# EAGLE design pic_can_switch_v2 (EAGLE 4.16)
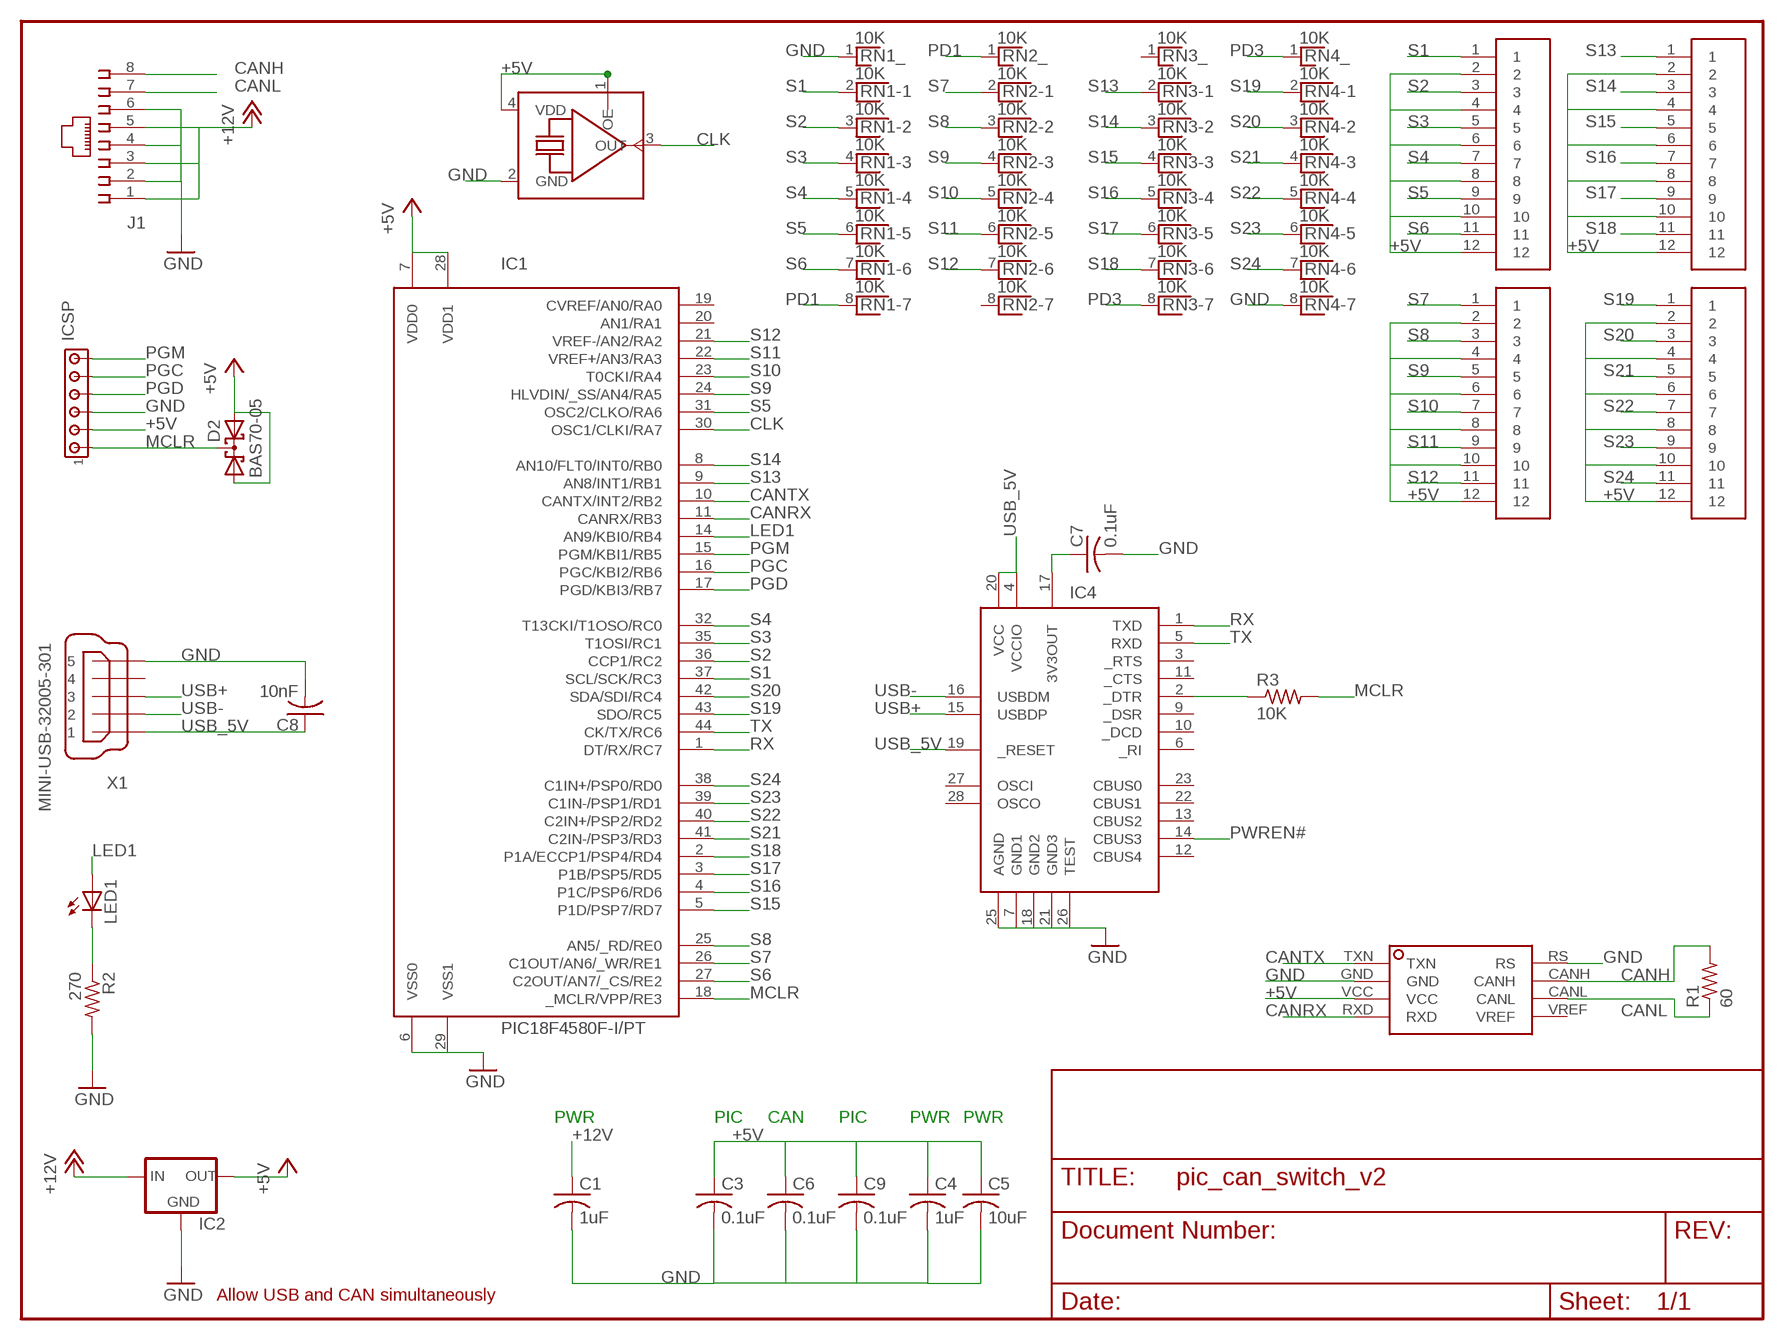
[diagram p0: schematic, sheet 1]

## Parts
C1  1uF  C-USC1206  [C1206]
C3  0.1uF  C-USC0805  [C0805]
C4  1uF  C-USC1206  [C1206]
C5  10uF  C-USC1210  [C1210]
C6  0.1uF  C-USC0805  [C0805]
C7  0.1uF  C-USC0805  [C0805]
C8  10nF  C-USC0805  [C0805]
C9  0.1uF  C-USC0805  [C0805]
D2  BAS70-05  [SOT23]
IC1  PIC18F4580F-I/PT  [TQFP44]
IC2  78XXL  [78XXL]
IC3  UC5350D  [SOIC8]
IC4  FT232RL  [SSOP28DB]
ICSP  MTA06-100  [10X06MTA]
J1  555166-1  [555166-1]
LED1  LEDCHIPLED_0805  [CHIPLED_0805]
R1  60  R-US_R0805  [R0805]
R2  270  R-US_R0805  [R0805]
R3  10K  R-US_R0805  [R0805]
RN1  10K  RNX7  [RN-8]
RN2  10K  RNX7  [RN-8]
RN3  10K  RNX7  [RN-8]
RN4  10K  RNX7  [RN-8]
TB1  MPT0.5/12-2.54  [MPT0.5/12-2.54]
TB2  MPT0.5/12-2.54  [MPT0.5/12-2.54]
TB3  MPT0.5/12-2.54  [MPT0.5/12-2.54]
TB4  MPT0.5/12-2.54  [MPT0.5/12-2.54]
U$1  CSX-750F  [CSX-750F]
X1  MINI-USB-32005-301  [32005-301]

## Nets
+5V: C3.1 C4.1 C5.1 C6.1 C9.1 D2.1(A1) D2.2(A2) IC1.7(VDD0) IC1.28(VDD1) IC2.OUT IC3.VCC ICSP.2 TB1.2 TB1.4 TB1.6 TB1.8 TB1.10 TB1.12 TB2.2 TB2.4 TB2.6 TB2.8 TB2.10 TB2.12 TB3.2 TB3.4 TB3.6 TB3.8 TB3.10 TB3.12 TB4.2 TB4.4 TB4.6 TB4.8 TB4.10 TB4.12 U$1.1(OE) U$1.4(VDD)
+12V: C1.1 IC2.IN J1.1 J1.3 J1.5
CANH: IC3.CANH J1.8 R1.2
CANL: IC3.CANL J1.7 R1.1
CANRX: IC1.11(CANRX/RB3) IC3.RXD
CANTX: IC1.10(CANTX/INT2/RB2) IC3.TXN
CLK: IC1.30(OSC1/CLKI/RA7) U$1.3(OUT)
GND: C1.2 C3.2 C4.2 C5.2 C6.2 C7.2 C8.2 C9.2 IC1.6(VSS0) IC1.29(VSS1) IC2.GND IC3.GND IC3.RS IC4.7(GND1) IC4.18(GND2) IC4.21(GND3) IC4.25(AGND) IC4.26(TEST) ICSP.3 J1.2 J1.4 J1.6 R2.2 RN1.1 RN4.8 U$1.2(GND) X1.5
LED1: IC1.14(AN9/KBI0/RB4) LED1.A
MCLR: D2.3(C) IC1.18(_MCLR/VPP/RE3) ICSP.1 R3.2
N$2: LED1.C R2.1
N$4: IC4.2(_DTR) R3.1
N$5: C7.1 IC4.17(3V3OUT)
PD1: RN1.8 RN2.1
PD3: RN3.8 RN4.1
PGC: IC1.16(PGC/KBI2/RB6) ICSP.5
PGD: IC1.17(PGD/KBI3/RB7) ICSP.4
PGM: IC1.15(PGM/KBI1/RB5) ICSP.6
PWREN#: IC4.14(CBUS3)
RX: IC1.1(DT/RX/RC7) IC4.1(TXD)
S1: IC1.37(SCL/SCK/RC3) RN1.2 TB1.1
S2: IC1.36(CCP1/RC2) RN1.3 TB1.3
S3: IC1.35(T1OSI/RC1) RN1.4 TB1.5
S4: IC1.32(T13CKI/T1OSO/RC0) RN1.5 TB1.7
S5: IC1.31(OSC2/CLKO/RA6) RN1.6 TB1.9
S6: IC1.27(C2OUT/AN7/_CS/RE2) RN1.7 TB1.11
S7: IC1.26(C1OUT/AN6/_WR/RE1) RN2.2 TB2.1
S8: IC1.25(AN5/_RD/RE0) RN2.3 TB2.3
S9: IC1.24(HLVDIN/_SS/AN4/RA5) RN2.4 TB2.5
S10: IC1.23(T0CKI/RA4) RN2.5 TB2.7
S11: IC1.22(VREF+/AN3/RA3) RN2.6 TB2.9
S12: IC1.21(VREF-/AN2/RA2) RN2.7 TB2.11
S13: IC1.9(AN8/INT1/RB1) RN3.2 TB3.1
S14: IC1.8(AN10/FLT0/INT0/RB0) RN3.3 TB3.3
S15: IC1.5(P1D/PSP7/RD7) RN3.4 TB3.5
S16: IC1.4(P1C/PSP6/RD6) RN3.5 TB3.7
S17: IC1.3(P1B/PSP5/RD5) RN3.6 TB3.9
S18: IC1.2(P1A/ECCP1/PSP4/RD4) RN3.7 TB3.11
S19: IC1.43(SDO/RC5) RN4.2 TB4.1
S20: IC1.42(SDA/SDI/RC4) RN4.3 TB4.3
S21: IC1.41(C2IN-/PSP3/RD3) RN4.4 TB4.5
S22: IC1.40(C2IN+/PSP2/RD2) RN4.5 TB4.7
S23: IC1.39(C1IN-/PSP1/RD1) RN4.6 TB4.9
S24: IC1.38(C1IN+/PSP0/RD0) RN4.7 TB4.11
TX: IC1.44(CK/TX/RC6) IC4.5(RXD)
USB+: IC4.15(USBDP) X1.3
USB-: IC4.16(USBDM) X1.2
USB_5V: C8.1 IC4.4(VCCIO) IC4.19(_RESET) IC4.20(VCC) X1.1
Unconnected: IC1.19(CVREF/AN0/RA0) IC1.20(AN1/RA1) IC3.VREF IC4.3(_RTS) IC4.6(_RI) IC4.9(_DSR) IC4.10(_DCD) IC4.11(_CTS) IC4.12(CBUS4) IC4.13(CBUS2) IC4.22(CBUS1) IC4.23(CBUS0) IC4.27(OSCI) IC4.28(OSCO) RN2.8 RN3.1 X1.4

## Notes on the sheet
- PWR | PIC | CAN | PIC | PWR | PWR
- Allow USB and CAN simultaneously

## Library data of the parts
C1 C3-C9 = rcl:C-US: CAPACITOR, American symbol
D2 = diode:BAS70-05: Silicon Schottky Diodes General-purpose diode for high-speed switching
IC1 = microchip-pic18f2480_2580_4480_4580:PIC18F4580: Microchip <http://microchip.com> PIC18F4580 <http://www.microchip.com/stellent/idcplg?IdcService=SS_GET_PAGE&nodeId=1335&dDocName=en020615> FLASH Microcontroller Changelog 20060722 Brandon Fosdick <http://bfoz.net><bfoz@bfoz.net> Device entry cloned from PIC18*4550 Massive HTML fixup Device Features Feature PIC18*4550 Program Memory (bytes) 32K Program Memory (instructions) 16384 I/O Pins 36 I/O Ports A, B, C, D, E Capture/Compare/PWM Modules 1 Enhanced Capture/Compare/PWM Modules 1 Parallel Communications (PSP) Yes 10-bit Analog-to-Digital Module 13 input Channels Package Types 40-pin PDIP 44-pin TQFP 44-pin QFN Notes: F only after 18, means standard voltage range from 4.2v to 5.5v LF after 18, means extended voltage range from 2.0v to 5.5v T after entire device number, means supplied in tape and reel TQFP packages only -E before / denotes extended temperature range from -40°C to +120°C -I before / denotes industrial temperature range from -40°C to +85°C /PT suffix denotes TQFP package /SO suffix denotes SOIC package /SP suffix denotes Skinny Plastic DIP package /P suffix denotes Plastic DIP package /ML suffix denotes QFN package
IC2 = v-reg:78XXL: VOLTAGE REGULATOR
IC3 = house:UC5350: CAN Tranceiver
IC4 = ftdichip:FT232RL: USB UART 4th Generation USB UART (USB <-> Serial) Controller
ICSP = con-amp:MTA06-100: AMP connector
J1 = con-amp:555166-1: AMP connector
LED1 = led:LED: LED OSRAM: - CHIPLED LG R971, LG N971, LY N971, LG Q971, LY Q971, LO R971, LY R971 LH N974, LH R974 LS Q976, LO Q976, LY Q976 LO Q996 - Hyper CHIPLED LW Q18S LB Q993, LB Q99A, LB R99A - SideLED LS A670, LO A670, LY A670, LG A670, LP A670 LB A673, LV A673, LT A673, LW A673 LH A674 LY A675 LS A676, LA A676, LO A676, LY A676, LW A676 LS A679, LY A679, LG A679 - Hyper Micro SIDELED® LS Y876, LA Y876, LO Y876, LY Y876 LT Y87S - SmartLED LW L88C, LW L88S LB L89C, LB L89S, LG L890 LS L89K, LO L89K, LY L89K LS L896, LA L896, LO L896, LY L896 - TOPLED LS T670, LO T670, LY T670, LG T670, LP T670 LSG T670, LSP T670, LSY T670, LOP T670, LYG T670 LG T671, LOG T671, LSG T671 LB T673, LV T673, LT T673, LW T673 LH T674 LS T676, LA T676, LO T676, LY T676, LB T676, LH T676, LSB T676, LW T676 LB T67C, LV T67C, LT T67C, LS T67K, LO T67K, LY T67K, LW E67C LS E67B, LA E67B, LO E67B, LY E67B, LB E67C, LV E67C, LT E67C LW T67C LS T679, LY T679, LG T679 LS T770, LO T770, LY T770, LG T770, LP T770 LB T773, LV T773, LT T773, LW T773 LH T774 LS E675, LA E675, LY E675, LS T675 LS T776, LA T776, LO T776, LY T776, LB T776 LHGB T686 LT T68C, LB T68C - Hyper Mini TOPLED® LB M676 - Mini TOPLED Santana® LG M470 LS M47K, LO M47K, LY M47K Source: http://www.osram.convergy.de - LUMILED® LXK2-PW12-R00, LXK2-PW12-S00, LXK2-PW14-U00, LXK2-PW14-V00 LXK2-PM12-R00, LXK2-PM12-S00, LXK2-PM14-U00 LXK2-PE12-Q00, LXK2-PE12-R00, LXK2-PE12-S00, LXK2-PE14-T00, LXK2-PE14-U00 LXK2-PB12-K00, LXK2-PB12-L00, LXK2-PB12-M00, LXK2-PB14-N00, LXK2-PB14-P00, LXK2-PB14-Q00 LXK2-PR12-L00, LXK2-PR12-M00, LXK2-PR14-Q00, LXK2-PR14-R00 LXK2-PD12-Q00, LXK2-PD12-R00, LXK2-PD12-S00 LXK2-PH12-R00, LXK2-PH12-S00 LXK2-PL12-P00, LXK2-PL12-Q00, LXK2-PL12-R00 Source: www.luxeon.com
R1-R3 = rcl:R-US_: RESISTOR, American symbol
RN1-RN4 = resistor-net:RNX7: RESISTOR NETWORK
TB1-TB4 = house:MPT0.5: Pheonix Contact Micro-Pitch Terminal Block
U$1 = house:CSX-750F: Citizen CMOS/TTL SMD Oscillator
X1 = con-cypressindustries:MINI-USB-: MINI USB-B Conector Source: www.cypressindustries.com

## Board
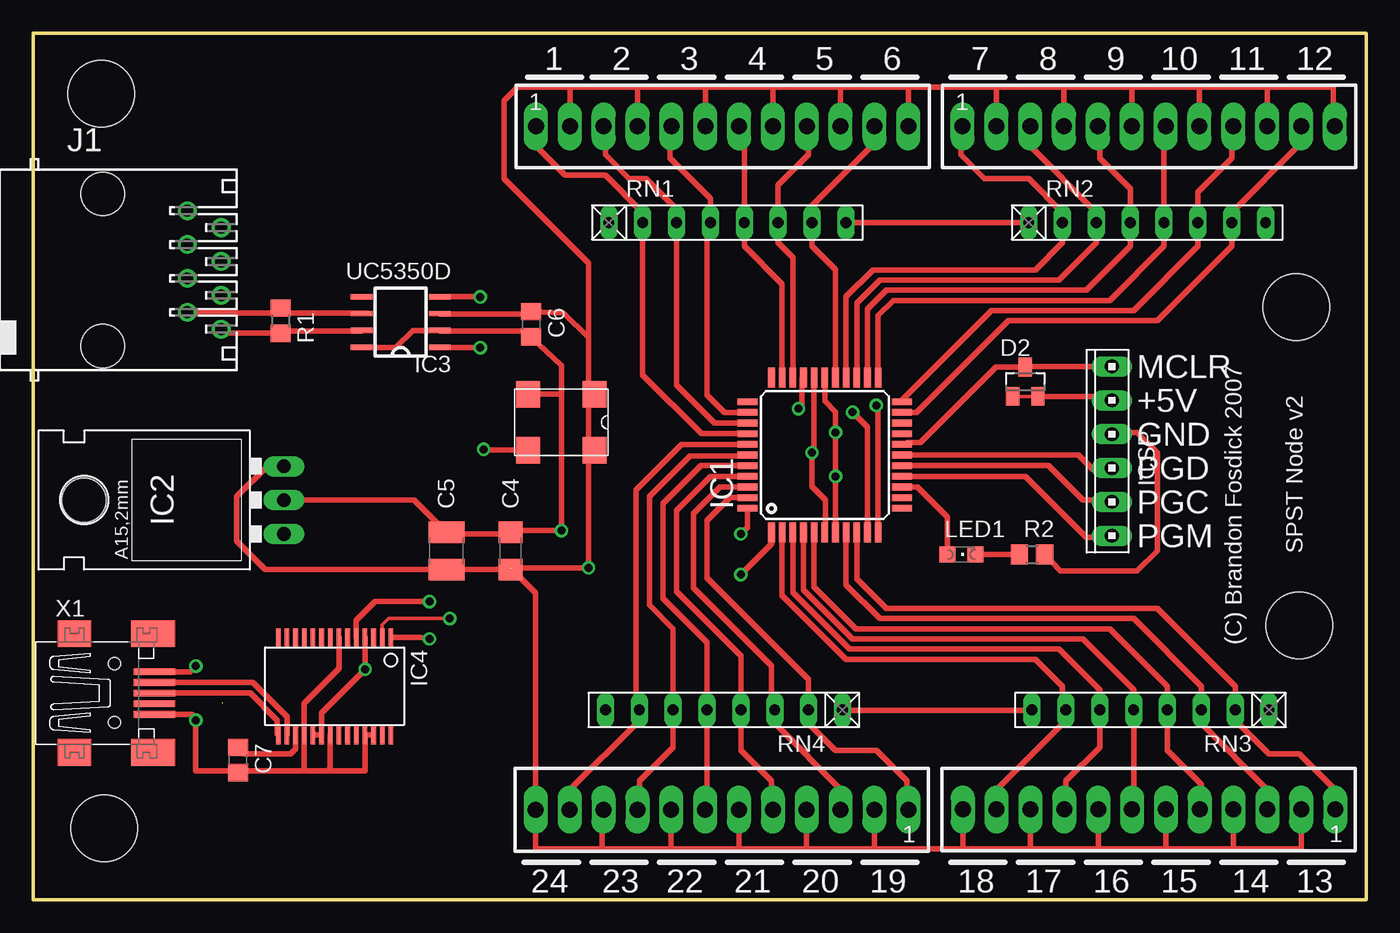
[diagram p1: board, top side]
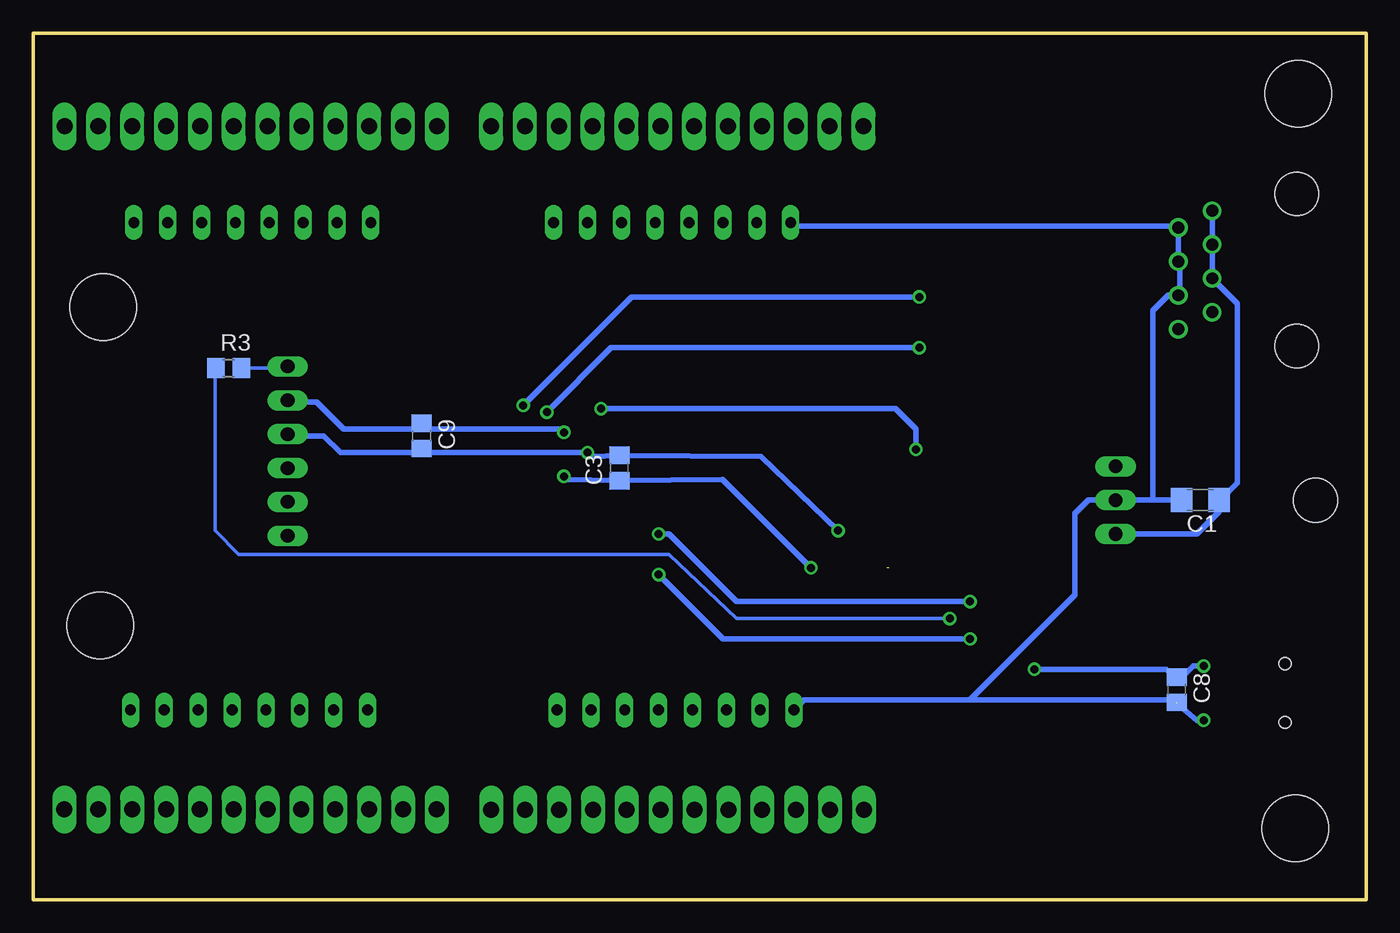
[diagram p2: board, bottom side, seen from below]

Size 100 x 65 mm. Coordinates in mm from the lower left corner, seen from the top.
Outline: 0,0 0,65 100,65 100,0 0,0
Copper layers (1*16): Top 0.035mm / dielectric 1.5mm / Bottom 0.035mm
Design rules "default": minimum track width 10mil, minimum drill 24mil, track to track 8mil, track to pad 8mil, pad to pad 8mil, via to via 8mil, smd to smd 8mil, copper to edge 40mil, drill to drill 8mil, minimum pad ring 10mil, minimum via ring 8mil, stop-mask expansion 0mil, vias tented up to drill 0mil, thermal gap 10mil
Holes 5 mm at 5.08,60.45 5.33,5.33 94.74,44.45 95,20.57

### Footprints (pad centres in the part's own frame; a part is rotated, then mirrored left to right if it is on the bottom)
C1206 = smd 1.6 x 1.8: 1 -1.4,0; 2 1.4,0
C0805 = smd 1.3 x 1.5: 1 -0.95,0; 2 0.95,0
C1210 = smd 1.6 x 2.7: 1 -1.4,0; 2 1.4,0
SOT23 = smd 1 x 1.4: 1 -0.95,-1.1; 2 0.95,-1.1; 3 0,1.1
TQFP44 = smd 1.5 x 0.5: 1 -5.8,4; 2 -5.8,3.2; 3 -5.8,2.4; 4 -5.8,1.6; 5 -5.8,0.8; 6 -5.8,0; 7 -5.8,-0.8; 8 -5.8,-1.6; 9 -5.8,-2.4; 10 -5.8,-3.2; 11 -5.8,-4; 23 5.8,-4; 24 5.8,-3.2; 25 5.8,-2.4; 26 5.8,-1.6; 27 5.8,-0.8; 28 5.8,0; 29 5.8,0.8; 30 5.8,1.6; 31 5.8,2.4; 32 5.8,3.2; 33 5.8,4 | smd 0.5 x 1.5: 12 -4,-5.8; 13 -3.2,-5.8; 14 -2.4,-5.8; 15 -1.6,-5.8; 16 -0.8,-5.8; 17 0,-5.8; 18 0.8,-5.8; 19 1.6,-5.8; 20 2.4,-5.8; 21 3.2,-5.8; 22 4,-5.8; 34 4,5.8; 35 3.2,5.8; 36 2.4,5.8; 37 1.6,5.8; 38 0.8,5.8; 39 0,5.8; 40 -0.8,5.8; 41 -1.6,5.8; 42 -2.4,5.8; 43 -3.2,5.8; 44 -4,5.8
78XXL = drill 1.016 long: GND 0,-3.81; IN -2.54,-3.81; OUT 2.54,-3.81 | hole 3.302: 0,11.176
SOIC8 = smd 1.626 x 0.406: CANH 2.934,1.27; CANL 2.934,0; GND -2.934,1.27; RS 2.934,2.54; RXD -2.934,-1.27; TXN -2.934,2.54; VCC -2.934,0; VREF 2.934,-1.27
SSOP28DB = smd 0.348 x 1.397: 1 -4.225,-3.656; 2 -3.575,-3.656; 3 -2.925,-3.656; 4 -2.275,-3.656; 5 -1.625,-3.656; 6 -0.975,-3.656; 7 -0.325,-3.656; 8 0.325,-3.656; 9 0.975,-3.656; 10 1.625,-3.656; 11 2.275,-3.656; 12 2.925,-3.656; 13 3.575,-3.656; 14 4.225,-3.656; 15 4.225,3.656; 16 3.575,3.656; 17 2.925,3.656; 18 2.275,3.656; 19 1.625,3.656; 20 0.975,3.656; 21 0.325,3.656; 22 -0.325,3.656; 23 -0.975,3.656; 24 -1.625,3.656; 25 -2.275,3.656; 26 -2.925,3.656; 27 -3.575,3.656; 28 -4.225,3.656
10X06MTA = drill 1.016 long: 1 6.35,0; 2 3.81,0; 3 1.27,0; 4 -1.27,0; 5 -3.81,0; 6 -6.35,0
555166-1 = drill 0.889 round: 1 -4.445,5.207; 2 -3.175,7.747; 3 -1.905,5.207; 4 -0.635,7.747; 5 0.635,5.207; 6 1.905,7.747; 7 3.175,5.207; 8 4.445,7.747 | hole 3.251: -5.715,-1.143; 5.715,-1.143
CHIPLED_0805 = smd 1.2 x 1.2: A 0,-1.05; C 0,1.05
R0805 = smd 1.3 x 1.5: 1 -0.95,0; 2 0.95,0
RN-8 = drill 0.813 long: 1 -8.89,0; 2 -6.35,0; 3 -3.81,0; 4 -1.27,0; 5 1.27,0; 6 3.81,0; 7 6.35,0; 8 8.89,0
MPT0.5/12-2.54 = drill 1.2 long: 1 -12.7,0; 2 -10.16,0; 3 -7.62,0; 4 -5.08,0; 5 -2.54,0; 6 0,0; 7 2.54,0; 8 5.08,0; 9 7.62,0; 10 10.16,0; 11 12.7,0; 12 15.24,0
CSX-750F = smd 1.8 x 2: 1 -2.5,-2.1; 2 2.5,-2.1; 3 2.5,2.1; 4 -2.5,2.1
32005-301 = smd 3.1 x 0.5: 1 3,1.6; 2 3,0.8; 3 3,0; 4 3,-0.8; 5 3,-1.6 | smd 2.5 x 2: M1 -3,-4.45; M2 -3,4.45 | smd 3.3 x 2: M3 2.9,4.45; M4 2.9,-4.45 | hole 0.9: 0,2.2; 0,-2.2

### Placement (x,y rotation side)
C1  12.45,29.97 180 bottom
C3  56.03,32.38 90 bottom
C4  35.81,26.16 90 top
C5  30.99,26.16 90 top
C6  37.36,43.17 270 top
C7  15.36,10.47 270 top
C8  14.22,15.75 270 bottom
C9  70.87,34.8 270 bottom
D2  74.42,38.86 0 top
IC1  59.38,33.35 90 top
IC2  14.99,29.97 90 top
IC3  27.56,43.97 180 top
IC4  22.61,16 180 top
ICSP  80.92,33.65 90 top
J1  6.35,47.24 270 top
LED1  69.63,25.89 270 top
R1  18.54,43.43 270 top
R2  74.93,25.91 0 top
R3  85.34,39.88 0 bottom
RN1  52.07,50.8 0 top
RN2  83.57,50.8 0 top
RN3  83.82,14.22 180 top
RN4  51.82,14.22 180 top
TB1  50.41,58.02 0 top
TB2  82.42,58.02 0 top
TB3  84.97,6.75 180 top
TB4  52.94,6.74 180 top
U$1  39.62,35.81 180 top
X1  6.1,15.49 0 top

### Tracks (layer width: path | path; a pad name or v marks a point on that pad's centre or on a via)
+5V  (via drill 0.6)  (1 unrouted)
  Top 0.254: ICSP.2 80.91,37.46 80.6,37.76 | 75.44,37.76 D2.2 | D2.1 75.44,37.76 | 75.44,37.76 75.44,37.59
  Top 0.406: 30.86,24.76 C5.1 17.4,24.76 15.24,26.92 15.24,30.23 17.53,32.51 IC2.OUT | 30.86,24.76 C4.1 35.94,24.89 v41.66,24.89 41.66,28.45 | 30.86,24.76 30.73,24.64 | 41.66,28.45 41.66,28.7 | TB1.2 40.25,60.96 40.13,60.96 | 40.13,60.96 36.32,60.96 35.31,59.94 35.31,54.1 41.66,47.75 41.66,42.16 | 41.66,28.45 41.66,33.78 | 41.66,33.78 41.66,37.85 | 41.66,37.85 41.66,42.16 | IC3.VCC 30.52,43.94 37.34,43.94 37.34,44 C6.1 39.8,44.02 41.66,42.16 | TB1.4 45.33,60.96 45.21,60.96 | 40.13,60.96 45.21,60.96 | TB1.6 50.41,60.96 50.29,60.96 | 45.21,60.96 50.29,60.96 | TB1.8 55.49,60.96 55.37,60.96 | 50.29,60.96 55.37,60.96 | TB1.10 60.57,60.96 60.45,60.96 | 55.37,60.96 60.45,60.96 | 65.65,60.96 TB1.12 | 60.45,60.96 65.65,60.96 | 72.26,60.96 TB2.2 | 65.65,60.96 72.26,60.96 | TB2.4 77.34,60.96 77.22,60.96 | 72.26,60.96 77.22,60.96 | TB2.6 82.42,60.96 82.3,60.96 | 77.22,60.96 82.3,60.96 | TB2.8 87.5,60.96 87.38,60.96 | 82.3,60.96 87.38,60.96 | TB2.10 92.58,60.96 92.46,60.96 | 87.38,60.96 92.46,60.96 | TB2.12 97.66,57.91 97.54,57.91 97.54,60.96 92.46,60.96 | IC1.28 59.38,37.4 60.2,36.58 v60.2,35.05 v60.2,31.75 60.2,27.69 60.18,27.67 IC1.7 | 42.67,3.81 37.7,3.81 TB4.12 37.7,23.01 35.81,24.89 | 42.78,6.6 42.93,6.6 | 42.78,6.6 TB4.10 | 42.67,3.81 42.67,6.6 42.78,6.6 | 47.86,3.81 TB4.8 | 42.67,3.81 47.86,3.81 | TB4.6 52.94,3.81 52.83,3.81 | 47.86,3.81 52.83,3.81 | 58.02,3.81 TB4.4 | 52.83,3.81 58.02,3.81 | TB4.2 63.1,3.81 62.99,3.81 | 58.02,3.81 62.99,3.81 | 69.73,3.81 TB3.12 | 62.99,3.81 69.73,3.81 | 74.81,3.81 TB3.10 | 69.73,3.81 74.81,3.81 | 79.89,3.81 TB3.8 | 74.81,3.81 79.89,3.81 | 84.97,3.81 TB3.6 | 79.89,3.81 84.97,3.81 | 90.05,3.81 TB3.4 | 84.97,3.81 90.05,3.81
  Top 0.406: TB3.2 95.13,3.81 90.05,3.81 | U$1.1 41.66,37.91 41.66,37.85 | U$1.4 41.66,33.71 41.66,33.78 | 80.6,37.76 D2.2
  Bottom 0.254: 80.77,37.34 80.89,37.46 ICSP.2
  Bottom 0.406: v60.2,31.75 60.16,31.53 C3.1 48.29,31.53 v41.66,24.89 | 70.36,35.31 59.94,35.31 v60.2,35.05 | 70.36,35.31 C9.1 | 70.36,35.31 76.71,35.31 78.74,37.34 80.77,37.34
+12V
  Bottom 0.406: IC2.IN 12.7,27.43 11.05,29.09 C1.1 10.92,29.97 9.65,31.24 9.65,44.7 J1.5 | J1.5 11.68,46.74 | J1.5 11.56,48.9 11.43,49.02 J1.3 11.56,51.44 11.43,51.56 J1.1
CANH
  Top 0.406: J1.8 14.45,42.63 14.45,42.52 18.57,42.52 | 18.57,42.52 R1.2 | IC3.CANH 24.64,42.69 24.64,42.67 18.72,42.67 18.57,42.52
CANL
  Top 0.254: 24.89,44.02 24.89,43.94 24.65,43.94 IC3.CANL
  Top 0.406: J1.7 11.95,44.02 18.43,44.02 R1.1 18.77,44.02 24.89,44.02 25.07,44.02
CANRX  (via drill 0.6)
  Top 0.406: v33.53,45.21 33.78,45.21 33.75,45.24 IC3.RXD | IC1.11 63.38,36.95 v63.25,37.08
  Bottom 0.406: v33.53,45.21 55.12,45.21 v63.25,37.08
CANTX  (via drill 0.6)
  Top 0.406: IC3.TXN 33.5,41.43 v33.53,41.4 | IC1.10 62.58,35.47 v61.47,36.58
  Bottom 0.406: v33.53,41.4 56.64,41.4 v61.47,36.58
CLK  (via drill 0.6)
  Top 0.406: IC1.30 57.74,39.12 57.66,39.12 57.66,37.08 v57.4,36.83 | U$1.3 33.78,33.71 v33.78,33.78
  Bottom 0.406: 43.94,36.83 43.18,36.83 | 43.94,36.83 v57.4,36.83 | v33.78,33.78 33.78,35.31 35.31,36.83 43.94,36.83
GND  (via drill 0.6)  (1 unrouted)
  Top 0.406: 20.32,9.65 20.33,11.19 IC4.18 20.33,12.2 20.32,12.19 20.32,14.73 22.93,17.34 IC4.7 | 15.49,9.65 12.19,9.65 v12.19,13.46 arc90 11.76,13.89 X1.5 | 15.49,9.65 20.32,9.65 | 20.32,9.65 22.1,9.65 | 22.1,9.65 24.89,9.65 24.88,10.91 IC4.25 24.88,12.2 24.89,12.19 25.05,12.35 IC4.26 | IC4.21 22.28,9.84 22.1,9.65 | IC2.GND 28.58,29.97 C5.2 30.99,27.43 35.68,27.43 C4.2 35.94,27.69 v39.62,27.69 39.62,37.85 | C7.2 15.46,9.62 15.49,9.65 | 27.15,41.43 IC3.RS 24.62,41.41 24.64,41.4 27.18,41.4 28.48,42.7 IC3.GND 30.52,42.67 37.08,42.67 37.08,42.6 C6.2 39.62,40.06 39.62,37.85 | IC1.29 58.58,33.53 v58.42,33.53 58.42,30.99 59.44,29.97 59.44,27.69 59.38,27.63 IC1.6 | R2.2 77.05,24.64 82.8,24.64 84.33,26.16 84.33,33.53 82.8,35.05 80.77,35.05 80.91,34.92 ICSP.3 | U$1.2 39.62,37.91 39.62,37.85
  Bottom 0.406: 16,29.97 C1.2 | 16,29.97 IC2.GND 20.83,29.97 21.84,28.96 21.84,22.86 29.72,14.99 | 16,29.97 16,44.2 14.86,45.34 J1.6 13.97,45.47 13.97,48.01 J1.4 J1.2 13.97,50.55 42.93,50.55 RN1.1 | 29.72,14.99 14.48,14.99 14.22,14.73 12.7,13.46 v12.19,13.46 11.94,13.46 | 70.87,33.53 v58.42,33.53 58.12,33.23 C3.2 45.42,33.23 v39.62,27.69 | 70.87,33.53 C9.2 | RN4.8 42.16,14.99 29.72,14.99 | 70.87,33.53 76.96,33.53 78.23,34.8 80.77,34.8 80.89,34.92 ICSP.3
LED1
  Top 0.406: IC1.14 66.33,30.95 68.58,28.7 68.58,25.91 LED1.A
MCLR
  Top 0.254: D2.3 74.42,39.88 74.54,40 | IC1.18 65.18,34.13 65.28,34.04 65.53,34.29
  Top 0.406: 74.54,40 ICSP.1 | D2.3 72.22,39.96 66.55,34.29 65.53,34.29
  Bottom 0.254: ICSP.1 80.92,40.02 81.03,40.13 81.28,39.88 R3.2
N$2
  Top 0.406: R2.1 74.17,25.91 74.15,25.89 LED1.C
N$4  (via drill 0.6)
  Top 0.254: IC4.2 26.18,20.59 26.67,21.08 v31.24,21.08
  Bottom 0.254: v31.24,21.08 47.24,21.08 52.32,25.91 84.58,25.91 86.36,27.69 86.36,39.37 86.11,39.62 86.29,39.81 R3.1
N$5
  Top 0.406: IC4.17 19.68,11.3 19.3,10.92 15.75,10.92 15.36,11.31 C7.1
PD1
  Top 0.406: RN1.8 RN2.1
PD3
  Top 0.406: 74.94,14.21 75.01,14.21 | 74.94,14.21 RN3.8 | RN4.1 74.94,14.21
PGC
  Top 0.406: IC1.16 76.16,32.55 78.74,29.97 80.78,29.97 ICSP.5
PGD
  Top 0.406: IC1.17 78.41,33.35 79.5,32.26 80.8,32.26 ICSP.4
PGM
  Top 0.406: IC1.15 74.42,31.75 78.99,27.18 80.8,27.18 ICSP.6
RX  (via drill 0.6)
  Top 0.406: IC1.1 55.38,26.68 v53.09,24.38 | IC4.1 29.06,19.66 v29.72,19.56
  Bottom 0.406: v29.72,19.56 48.26,19.56 v53.09,24.38
S1
  Top 0.406: TB1.1 37.59,57.91 37.59,56.64 39.88,54.36 42.93,54.36 45.72,51.56 RN1.2 45.72,39.37 50.14,34.95 IC1.37
S2
  Top 0.406: 43.05,58.03 42.93,58.17 | 43.05,58.03 TB1.3 | 43.05,58.03 42.93,57.91 42.93,55.88 44.7,54.1 45.97,54.1 48.26,51.82 RN1.3 48.26,38.61 51.12,35.75 IC1.36
S3
  Top 0.406: 47.87,58.03 48.01,58.17 | 47.87,58.03 TB1.5 | 47.87,58.03 47.75,57.91 47.75,55.63 50.8,52.58 RN1.4 50.8,50.55 50.55,50.29 50.55,37.85 51.84,36.55 IC1.35
S4
  Top 0.406: TB1.7 52.98,58.02 53.34,57.66 RN1.5 53.34,49.02 56.18,46.18 IC1.32
S5
  Top 0.406: TB1.9 58.03,58.03 58.17,58.17 58.17,55.88 55.88,53.59 RN1.6 55.88,49.28 56.98,48.18 IC1.31
S6
  Top 0.406: TB1.11 63.11,56.76 58.42,52.07 RN1.7 58.42,49.02 60.18,47.26 IC1.27
S7
  Top 0.406: TB2.1 69.72,58.05 69.6,58.17 69.6,55.88 71.37,54.1 74.68,54.1 77.22,51.56 RN2.2 77.22,49.28 75.18,47.24 62.99,47.24 60.98,45.23 IC1.26
S8
  Top 0.406: TB2.3 74.78,58.02 74.68,57.91 74.68,56.64 79.76,51.56 RN2.3 79.76,49.28 76.96,46.48 63.5,46.48 61.78,44.76 IC1.25
S9
  Top 0.406: TB2.5 79.9,58.02 80.01,57.91 80.01,55.63 82.3,53.34 RN2.4 82.3,49.02 78.99,45.72 64.01,45.72 62.58,44.29 IC1.24
S10
  Top 0.406: TB2.7 84.98,58.02 85.09,57.91 84.84,57.66 RN2.5 84.84,49.02 80.77,44.96 64.52,44.96 63.38,43.82 IC1.23
S11
  Top 0.406: TB2.9 90.02,58.02 89.92,57.91 89.92,55.63 87.38,53.09 RN2.6 87.38,49.02 82.55,44.2 71.88,44.2 65.18,37.49 IC1.22
S12
  Top 0.406: TB2.11 95.12,58.05 95,58.17 95,56.64 89.92,51.56 RN2.7 89.92,49.02 84.33,43.43 73.15,43.43 66.27,36.55 IC1.21
S13
  Top 0.406: TB3.1 97.64,6.75 97.54,6.86 97.54,8.38 95,10.92 92.71,10.92 90.17,13.46 RN3.2 90.17,16 84.33,21.84 64.01,21.84 61.78,24.07 IC1.9
S14
  Top 0.406: TB3.3 92.59,6.72 92.71,6.6 92.71,8.13 87.63,13.21 RN3.3 87.63,16 82.55,21.08 63.5,21.08 60.98,23.6 IC1.8
S15
  Top 0.406: TB3.5 87.51,6.72 87.63,6.6 87.63,8.64 85.09,11.18 RN3.4 85.09,16 80.77,20.32 61.72,20.32 58.58,23.46 IC1.5
S16
  Top 0.406: TB3.7 82.44,6.75 82.55,6.86 RN3.5 82.55,15.75 78.74,19.56 61.47,19.56 57.78,23.25 IC1.4
S17
  Top 0.406: TB3.9 77.32,6.75 77.22,6.86 77.47,7.11 77.47,8.89 80.01,11.43 RN3.6 80.01,15.75 76.96,18.8 61.21,18.8 56.98,23.03 IC1.3
S18
  Top 0.406: TB3.11 72.27,6.74 72.14,6.6 72.14,8.13 77.47,13.46 RN3.7 77.22,14.48 77.22,16 75.18,18.03 60.96,18.03 56.18,22.81 IC1.2
S19
  Top 0.406: TB4.1 65.64,6.71 65.53,6.6 65.53,8.89 63.25,11.18 60.2,11.18 58.17,13.21 RN4.2 58.17,16.51 50.55,24.13 50.55,28.45 52.25,30.15 IC1.43
S20
  Top 0.406: 60.56,6.71 60.45,6.6 | TB4.3 60.56,6.71 | 60.56,6.71 60.71,6.86 60.71,8.13 55.63,13.21 RN4.3 55.37,14.48 55.37,17.53 49.53,23.37 49.53,28.96 51.53,30.95 IC1.42
S21
  Top 0.406: TB4.5 55.48,6.71 55.37,6.6 55.37,8.89 53.09,11.18 RN4.4 53.09,18.29 48.26,23.11 48.26,29.21 50.8,31.75 IC1.41
S22
  Top 0.406: TB4.7 50.41,6.74 50.55,6.6 RN4.5 50.55,19.3 47.24,22.61 47.24,29.72 50.08,32.55 IC1.40
S23
  Top 0.406: TB4.9 45.21,6.86 45.47,7.11 45.47,8.89 48.01,11.43 RN4.6 48.01,20.32 46.23,22.1 46.23,30.23 49.28,33.27 53.5,33.27 IC1.39
S24
  Top 0.406: TB4.11 40.24,6.71 40.13,6.6 40.13,8.13 45.47,13.46 RN4.7 45.21,14.48 45.21,30.73 48.63,34.15 IC1.38
TX  (via drill 0.6)
  Top 0.406: IC1.44 53.58,27.93 v53.09,27.43 | IC4.5 24.23,20.93 25.65,22.35 v29.72,22.35
  Bottom 0.406: v29.72,22.35 47.24,22.35 52.32,27.43 v53.09,27.43
USB+
  Top 0.406: X1.3 16.26,15.49 18.29,13.46 18.29,12.45 IC4.15
USB-
  Top 0.406: X1.2 16.47,16.29 19.05,13.72 19.05,12.45 19.03,12.43 IC4.16
USB_5V  (via drill 0.6)
  Top 0.406: X1.1 11.76,17.09 v12.19,17.53 | v24.89,17.27 21.63,14.01 IC4.20 21.18,12.35 21.08,12.45 IC4.19 | v24.89,17.27 24.89,19.56 24.88,19.57 IC4.4 24.88,17.28 v24.89,17.27
  Bottom 0.406: 14.22,16.51 14.22,16.26 12.95,17.53 v12.19,17.53 | 14.22,16.51 C8.1 | v24.89,17.27 14.99,17.27 14.22,16.51

### Text on the board
Top: 1 Top
Bottom: 16 Bottom
Pads: 17 Pads
Vias: 18 Vias
Dimension: 20 Dimension
tPlace: 21 tPlace | MCLR | +5V | GND | PGD | PGC | PGM
tNames: 25 tName | 1 | 2 | 3 | 4 | 5 | 6 | 7 | 8 | 9 | 10 | 11 | 12 | SPST Node v2 | (C) Brandon Fosdick 2007 | 24 | 23 | 22 | 21 | 20 | 19 | 18 | 17 | 16 | 15 | 14 | 13
tStop: 29 tStop
bStop: 30 bStop